# Altium project PCB_Graduation_Thesis.PrjPcb
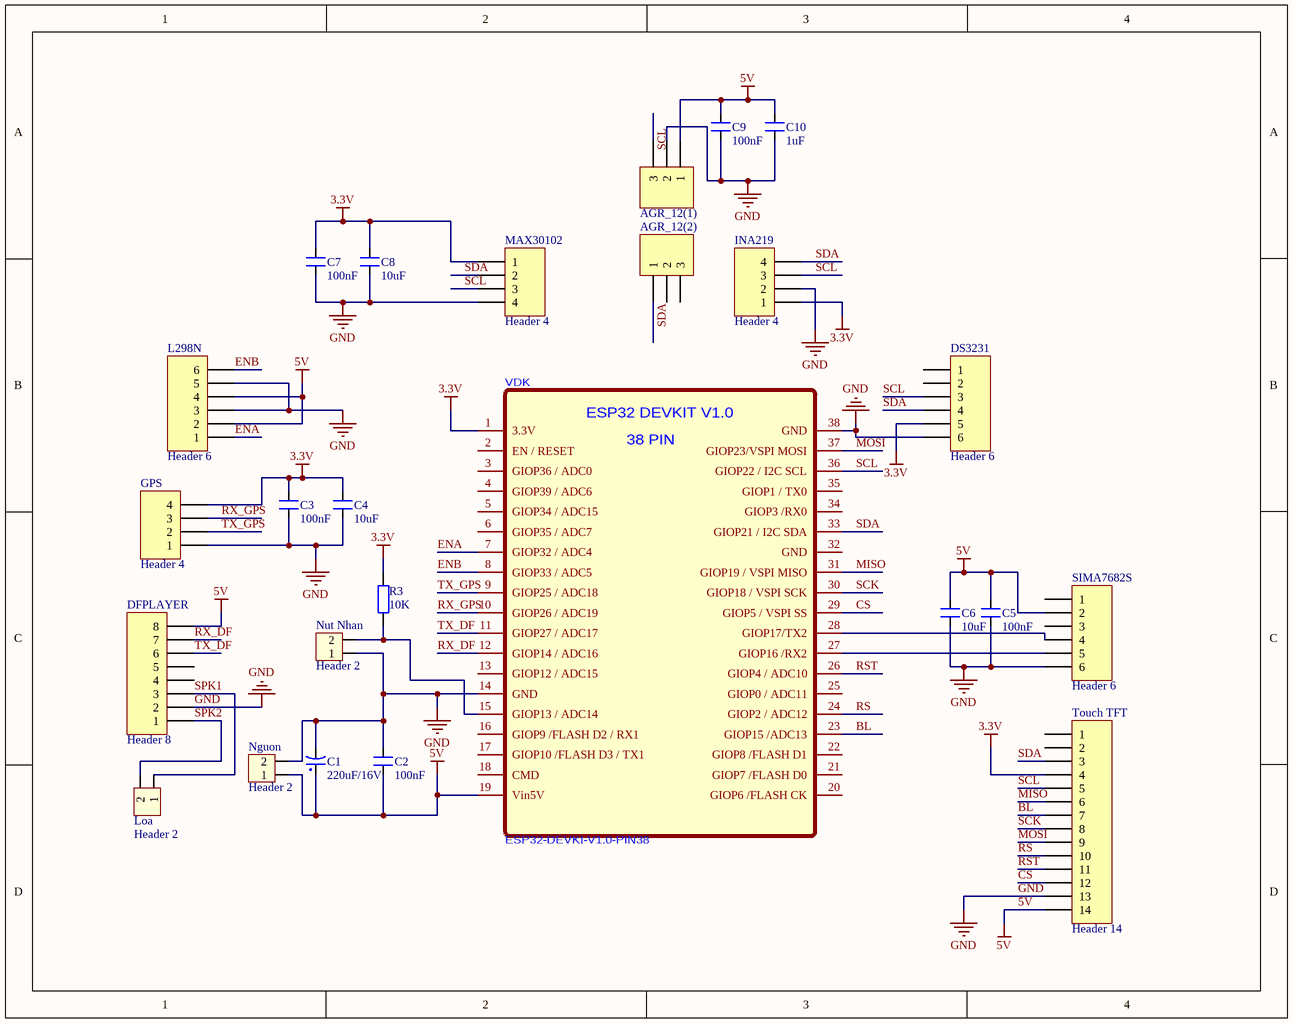
[diagram p0: Sheet.SchDoc]
1 sheet, 25 parts. Net scope: global (net labels, ports and power ports of the same name join across sheets).
Board file: PCB.PcbDoc

## Sheet Sheet.SchDoc
size A; SheetNumber: 1; SheetTotal: 1

### Parts
AGR_12(1)  (no value)  [HDR1X3]
AGR_12(2)  (no value)  [HDR1X3]
C1  220uF/16V  [CP1.5/3.4]
C2  100nF  [CN2]
C3  100nF  [CN2]
C4  10uF  [CN2]
C5  100nF  [CN2]
C6  10uF  [CN2]
C7  100nF  [CN2]
C8  10uF  [CN2]
C9  100nF  [CN2]
C10  1uF  [CN2]
DFPLAYER  Header 8  [HDR1X8]
DS3231  Header 6  [HDR1X6]
GPS  Header 4  [HDR1X4]
INA219  Header 4  [HDR1X4]
L298N  Header 6  [HDR1X6]
Loa  Header 2  [HED2]
MAX30102  Header 4  [HDR1X4]
Nguon  Header 2  [HED2]
Nut_Nhan  Header 2  [HED2]
R3  value 10K  [DIEN TRO 1/4 W]  (hidden comment: R0.4W)
SIMA7682S  Header 6  [HDR1X6]
Touch_TFT  Header 14  [HDR1X14]
VDK  ESP32-DEVKI-V1.0-PIN38  [ESP32-DEVKIT-V1.0-38PIN]

### Nets
3.3V: C3.2 C4.2 C7.2 C8.2 DS3231.5 GPS.4 INA219.1 MAX30102.1 R3.2 Touch_TFT.4 VDK.1(3.3V)
5V: AGR_12(1).1 C1.1 C2.1 C5.2 C6.2 C9.2 C10.2 DFPLAYER.8 L298N.2 L298N.4 Nguon.1 SIMA7682S.2 Touch_TFT.14 VDK.19(Vin5V)
GND: AGR_12(1).2 C1.2 C2.2 C3.1 C4.1 C5.1 C6.1 C7.1 C8.1 C9.1 C10.1 DFPLAYER.2 DS3231.6 GPS.1 INA219.2 L298N.3 L298N.5 MAX30102.4 Nguon.2 Nut_Nhan.1 SIMA7682S.6 Touch_TFT.13 VDK.14(GND) VDK.38(GND)
BL: Touch_TFT.7 VDK.23(GIOP15_/ADC13)
CS: Touch_TFT.12 VDK.29(GIOP5_/_VSPI_SS)
ENA: L298N.1 VDK.7(GIOP32_/_ADC4)
ENB: L298N.6 VDK.8(GIOP33_/_ADC5)
MISO: Touch_TFT.6 VDK.31(GIOP19_/_VSPI_MISO)
MOSI: Touch_TFT.9 VDK.37(GIOP23/VSPI_MOSI)
RS: Touch_TFT.10 VDK.24(GIOP2_/_ADC12)
RST: Touch_TFT.11 VDK.26(GIOP4_/_ADC10)
RX_DF: DFPLAYER.7 VDK.12(GIOP14_/_ADC16)
RX_GPS: GPS.3 VDK.10(GIOP26_/_ADC19)
SCK: Touch_TFT.8 VDK.30(GIOP18_/_VSPI_SCK)
SCL: AGR_12(1).3 DS3231.3 INA219.3 MAX30102.3 Touch_TFT.5 VDK.36(GIOP22_/_I2C_SCL)
SDA: AGR_12(2).1 DS3231.4 INA219.4 MAX30102.2 Touch_TFT.3 VDK.33(GIOP21_/_I2C_SDA)
SPK1: DFPLAYER.3 Loa.1
SPK2: DFPLAYER.1 Loa.2
TX_DF: DFPLAYER.6 VDK.11(GIOP27_/_ADC17)
TX_GPS: GPS.2 VDK.9(GIOP25_/_ADC18)
NetNut_Nhan_2: Nut_Nhan.2 R3.1 VDK.15(GIOP13_/_ADC14)
NetSIMA7682S_4: SIMA7682S.4 VDK.28(GIOP17/TX2)
NetSIMA7682S_5: SIMA7682S.5 VDK.27(GIOP16_/RX2)

Not connected (* = marked no-connect by the designer): AGR_12(2) 2 3; DFPLAYER 4 5; DS3231 1 2; SIMA7682S 1 3; Touch_TFT 1 2; VDK 2(EN_/_RESET) 3(GIOP36_/_ADC0) 4(GIOP39_/_ADC6) 5(GIOP34_/_ADC15) 6(GIOP35_/_ADC7) 13(GIOP12_/_ADC15) 16(GIOP9_/FLASH_D2_/_RX1) 17(GIOP10_/FLASH_D3_/_TX1) 18(CMD) 20(GIOP6_/FLASH_CK) 21(GIOP7_/FLASH_D0) 22(GIOP8_/FLASH_D1) 25(GIOP0_/_ADC11) 32(GND) 34(GIOP3_/RX0) 35(GIOP1_/_TX0)

### Notes on the sheet
- (in symbol ESP32-DEVKI-V1.0-PIN38) ESP32 DEVKIT V1.0; 38 PIN

### Library data of the parts
AGR_12(1) AGR_12(2) = Header 3: Header, 3-Pin; LatestRevisionDate: 17-Jul-2002; LatestRevisionNote: Re-released for DXP Platform.; Publisher: Altium Limited
C1 = CP4: Cap 1000uF/16V - 220uF/50V; Description 5: 4,7uF>10uF/250V_3,3uF>10uF/400V - 2,2uF>4,7uF/450V; Description 1: 2200uF-3300uF/6,3V - 1000uF-2200uF/10V; Description 2: 1000uF/16V - 470uF => 1000uF/25V - 100uF/100V; Description 3: 330uF>470uF/35V_220uF>470uF/50V_10uF>22uF/250V; Description 4: 220uF => 330uF/63V - 10uF =>33uF/160 - 200V; Value: 1000uF/16V
C2-C10 = CN2: Cap np 104 => 105pF; Value: 0.1uF
DFPLAYER = Header 8: Header, 8-Pin; LatestRevisionDate: 17-Jul-2002; LatestRevisionNote: Re-released for DXP Platform.; Publisher: Altium Limited
DS3231 L298N SIMA7682S = Header 6: Header, 6-Pin; LatestRevisionDate: 17-Jul-2002; LatestRevisionNote: Re-released for DXP Platform.; Publisher: Altium Limited
GPS INA219 MAX30102 = Header 4: Header, 4-Pin; LatestRevisionDate: 17-Jul-2002; LatestRevisionNote: Re-released for DXP Platform.; Publisher: Altium Limited
Loa Nguon Nut_Nhan = Hed2: Header 2 (Green); Value: Header 2
R3 = Res 1/4 W: Resistor; Published: 8-Jun-2000; LatestRevisionDate: 17-Jul-2002; LatestRevisionNote: Re-released for DXP Platform.; PackageReference: AXIAL-0.4; Publisher: Altium Limited
Touch_TFT = Header 14: Header, 14-Pin; LatestRevisionDate: 17-Jul-2002; LatestRevisionNote: Re-released for DXP Platform.; Publisher: Altium Limited